# Altium schematic sheet SBH_BMS.SchDoc: Sample Sheet Title
size B; Date: 12/31/2022; Author: Flip B; Organization: ORGANIZATION; Address1: ADDRESS 1; Address2: ADDRESS 2; Address3: ADDRESS 3; Address4: ADDRESS 4; DocumentNumber: 1; Revision: -; SheetNumber: 1; SheetTotal: 8; ENG_APP_DATE: --/--/--; DSN_APP_DATE: --/--/--; CHK_APP_DATE: --/--/--
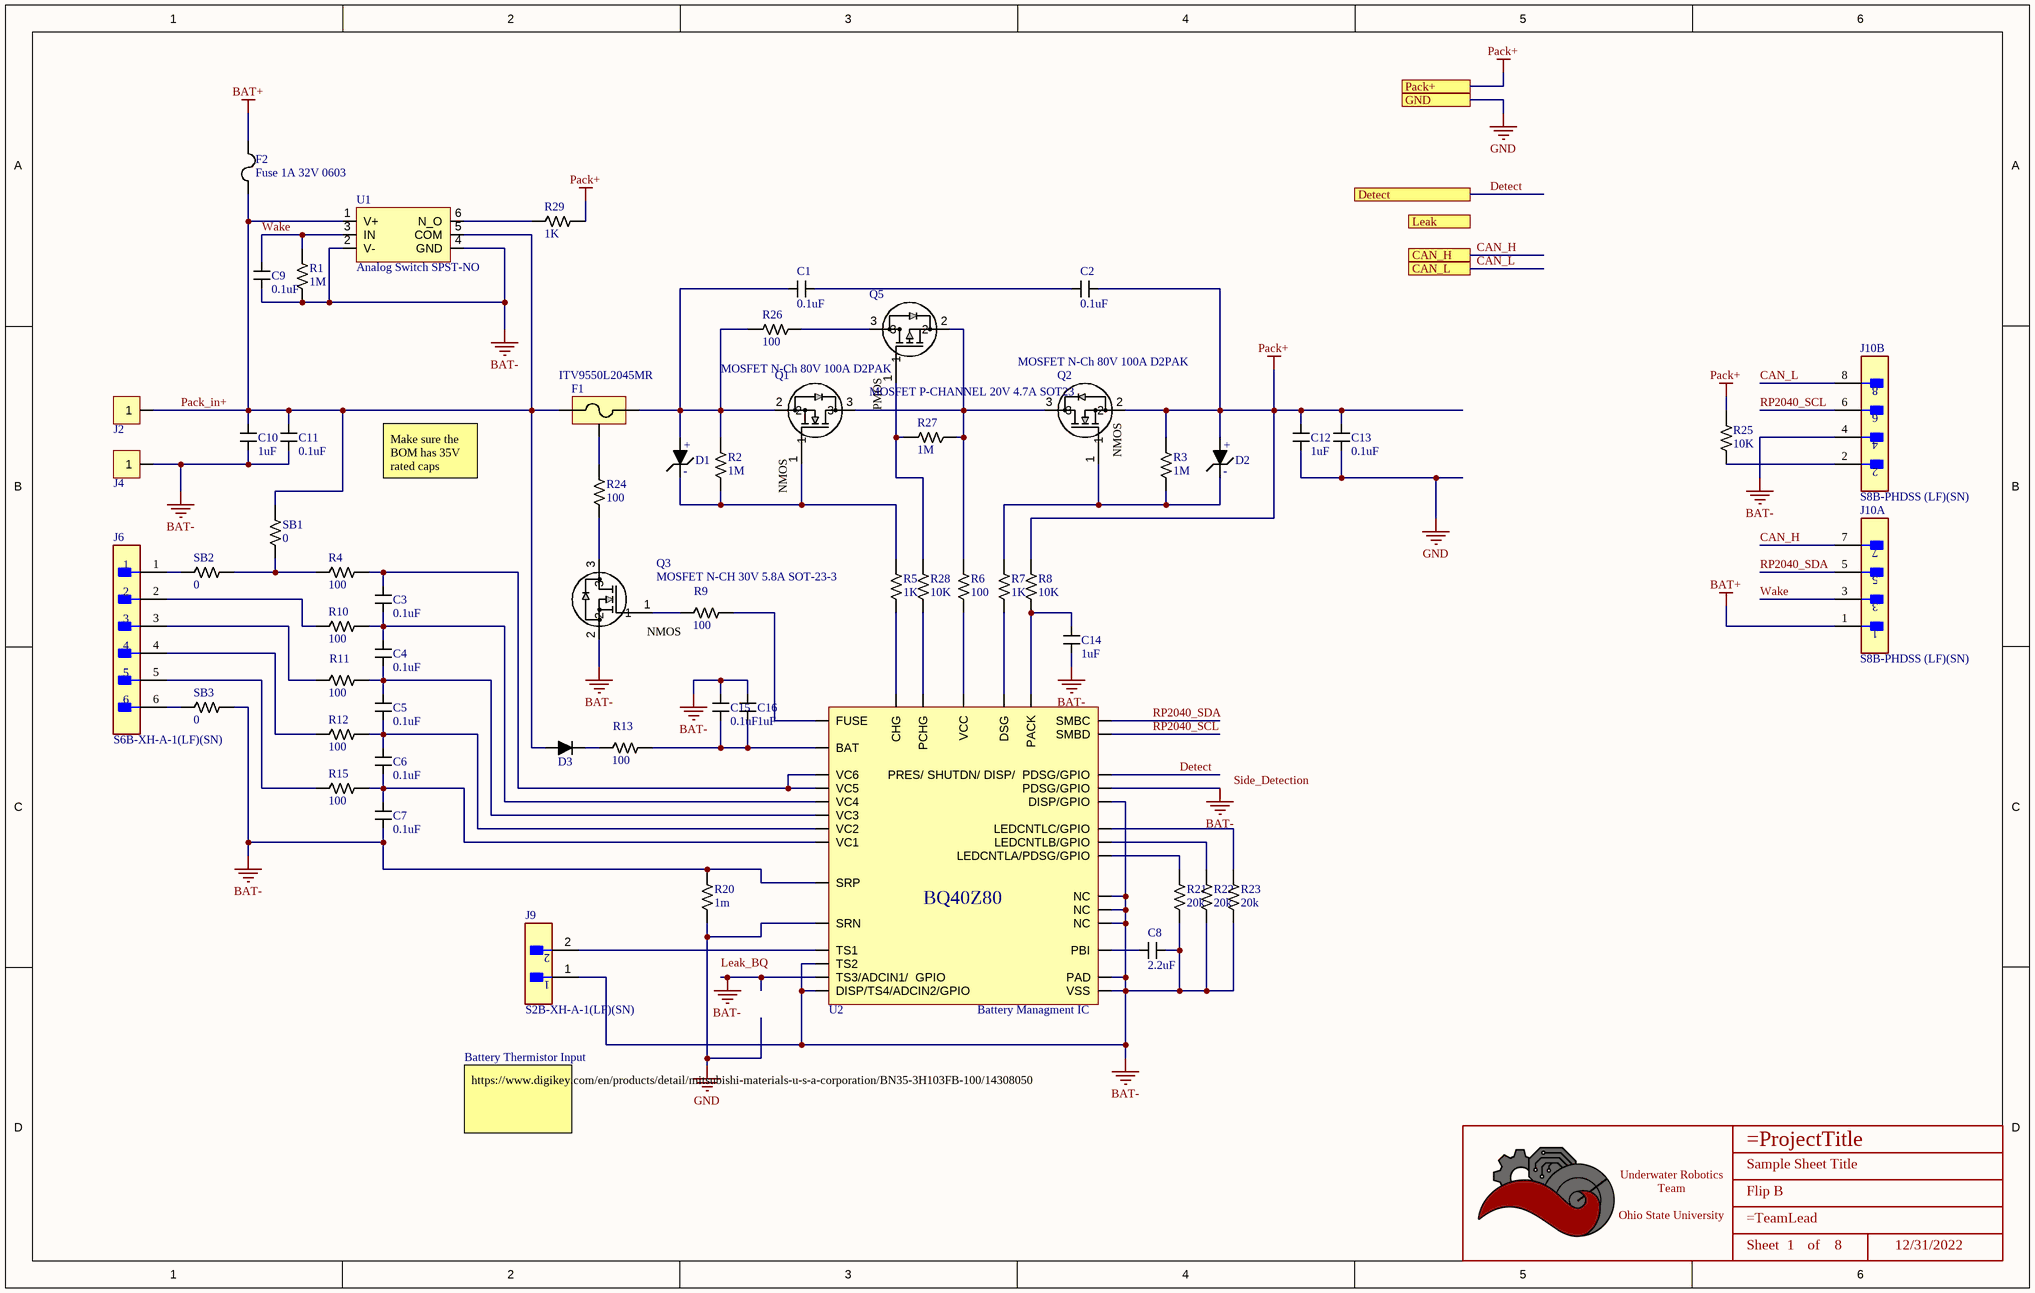
[diagram p0: SBH_BMS.SchDoc]

## Parts
*  Title_Block  [LOGO]  (value not drawn)  (graphical)
C1  value 0.1uF  [CAPACITOR_0402]  (hidden comment: 100nF Ceramic 25V)
C2  value 0.1uF  [CAPACITOR_0402]  (hidden comment: 100nF Ceramic 25V)
C3  value 0.1uF  [CAPACITOR_0402]  (hidden comment: 100nF Ceramic 25V)
C4  value 0.1uF  [CAPACITOR_0402]  (hidden comment: 100nF Ceramic 25V)
C5  value 0.1uF  [CAPACITOR_0402]  (hidden comment: 100nF Ceramic 25V)
C6  value 0.1uF  [CAPACITOR_0402]  (hidden comment: 100nF Ceramic 25V)
C7  value 0.1uF  [CAPACITOR_0402]  (hidden comment: 100nF Ceramic 25V)
C8  value 2.2uF  [CAPACITOR_0402]  (hidden comment: 2.2uF Ceramic 35V)
C9  value 0.1uF  [CAPACITOR_0402]  (hidden comment: 100nF Ceramic 25V)
C10  value 1uF  [CAPACITOR_0402]  (hidden comment: 1uF Ceramic 16V)
C11  value 0.1uF  [CAPACITOR_0402]  (hidden comment: 100nF Ceramic 25V)
C12  value 1uF  [CAPACITOR_0402]  (hidden comment: 1uF Ceramic 16V)
C13  value 0.1uF  [CAPACITOR_0402]  (hidden comment: 100nF Ceramic 25V)
C14  value 1uF  [CAPACITOR_0402]  (hidden comment: 1uF Ceramic 16V)
C15  value 0.1uF  [CAPACITOR_0402]  (hidden comment: 100nF Ceramic 25V)
C16  value 1uF  [CAPACITOR_0402]  (hidden comment: 1uF Ceramic 16V)
D1  Zener_Diode_16V_500mW  [SOD-123]  (value not drawn)
D2  Zener_Diode_16V_500mW  [SOD-123]  (value not drawn)
D3  MBR0520LT3G  [SOD-123]  (value not drawn)
F1  ITV9550L2045MR  [ITV9550]
F2  Fuse 1A 32V 0603  [2-SMD Fuse 0603]
J2  Redcube M4 Term 85A  [Redcube M4 Term 85A]  (value not drawn)
J4  Redcube M4 Term 85A  [Redcube M4 Term 85A]  (value not drawn)
J6  S6B-XH-A-1(LF)(SN)  [FP-S6B-XH-A-1_LF_SN-MFG]
J9  S2B-XH-A-1(LF)(SN)  [FP-S2B-XH-A-1_LF_SN-MFG]
J10  S8B-PHDSS (LF)(SN)  [FP-S8B-PHDSS_LF_SN-MFG]  (parts A,B of 2)
Q1  MOSFET N-Ch 80V 100A D2PAK  [D2PAK]
Q2  MOSFET N-Ch 80V 100A D2PAK  [D2PAK]
Q3  MOSFET N-CH 30V 5.8A SOT-23-3  [SOT-23-3]
Q5  MOSFET P-CHANNEL 20V 4.7A SOT23  [SOT-23-3]
R1  1M  [RESISTOR_0603]
R2  1M  [RESISTOR_0603]
R3  1M  [RESISTOR_0603]
R4  Value  (Ohms): 100  [RESISTOR_0402]  (hidden comment: 100 Ohm 5% 1/16W)
R5  Value  (Ohms): 1K  [RESISTOR_0402]  (hidden comment: 1k Ohm 1% 1/16W)
R6  Value  (Ohms): 100  [RESISTOR_0402]  (hidden comment: 100 Ohm 5% 1/16W)
R7  Value  (Ohms): 1K  [RESISTOR_0402]  (hidden comment: 1k Ohm 1% 1/16W)
R8  Value  (Ohms): 10K  [RESISTOR_0402]  (hidden comment: 10k Ohm 1% 1/16W)
R9  Value  (Ohms): 100  [RESISTOR_0402]  (hidden comment: 100 Ohm 5% 1/16W)
R10  Value  (Ohms): 100  [RESISTOR_0402]  (hidden comment: 100 Ohm 5% 1/16W)
R11  Value  (Ohms): 100  [RESISTOR_0402]  (hidden comment: 100 Ohm 5% 1/16W)
R12  Value  (Ohms): 100  [RESISTOR_0402]  (hidden comment: 100 Ohm 5% 1/16W)
R13  Value  (Ohms): 100  [RESISTOR_0402]  (hidden comment: 100 Ohm 5% 1/16W)
R15  Value  (Ohms): 100  [RESISTOR_0402]  (hidden comment: 100 Ohm 5% 1/16W)
R20  Value  (Ohms): 1m  [RES_CSS2H-3920]  (hidden comment: 1m Ohm 5% 8W)
R21  Value  (Ohms): 20k  [RESISTOR_0402]  (hidden comment: 20k Ohm 1% 1/16W)
R22  Value  (Ohms): 20k  [RESISTOR_0402]  (hidden comment: 20k Ohm 1% 1/16W)
R23  Value  (Ohms): 20k  [RESISTOR_0402]  (hidden comment: 20k Ohm 1% 1/16W)
R24  Value  (Ohms): 100  [RESISTOR_0402]  (hidden comment: 100 Ohm 5% 1/16W)
R25  Value  (Ohms): 10K  [RESISTOR_0603]  (hidden comment: 10k Ohm 5% 1/10W)
R26  Value  (Ohms): 100  [RESISTOR_0402]  (hidden comment: 100 Ohm 5% 1/16W)
R27  1M  [RESISTOR_0603]
R28  Value  (Ohms): 10K  [RESISTOR_0402]  (hidden comment: 10k Ohm 1% 1/16W)
R29  Value  (Ohms): 1K  [RESISTOR_0603]  (hidden comment: 1k Ohm 5% 1/8W)
SB1  Value  (Ohms): 0  [RESISTOR_0603]  (hidden comment: 0 Ohm Jumper No Fit)
SB2  Value  (Ohms): 0  [RESISTOR_0603]  (hidden comment: 0 Ohm Jumper No Fit)
SB3  Value  (Ohms): 0  [RESISTOR_0603]  (hidden comment: 0 Ohm Jumper No Fit)
U1  Analog Switch SPST-NO  [TSOT-23_S6]
U2  Battery Managment IC  [VQFN-32]

## Ports
CAN_H, CAN_L, Detect, GND, Leak, Pack+

## Nets
BAT+: F2.2 J10.1
BAT-: C7.2 C8.1 C9.2 C10.2 C11.2 C14.2 C15.1 C16.1 J4.1 J9.1 J10.4 Q3.2 R1.2 R20.1 R21.2 R22.2 R23.2 SB3.1 U1.2(V-) U1.4(GND) U2.7(NC) U2.8(SRP) U2.9(VSS) U2.11(TS2) U2.12(TS3/ADCIN1/__GPIO) U2.13(DISP/TS4/ADCIN2/GPIO) U2.14(NC) U2.15(DISP/GPIO) U2.16(PDSG/GPIO) U2.27(NC) U2.33(PAD)
GND: C12.2 C13.2 R20.2 U2.6(SRN) ; port GND
Pack+: C2.1 C12.1 C13.1 D2.1 Q2.2 R3.1 R8.1 R25.1 R29.1 ; port Pack+
CAN_H: J10.7 ; port CAN_H
CAN_L: J10.8 ; port CAN_L
Detect: U2.17(PRES/_SHUTDN/_DISP/__PDSG/GPIO) ; port Detect
Pack_in+: C10.1 C11.1 D3.1 F1.2 F2.1 J2.1 SB1.1 U1.1(V+) U1.5(COM)
RP2040_SCL: J10.6 U2.18(SMBD)
RP2040_SDA: J10.5 U2.19(SMBC)
Wake: C9.1 J10.3 R1.1 U1.3(IN)
NetC1_1: C1.1 C2.2
NetC1_2: C1.2 D1.1 F1.1 Q1.2 R2.1 R26.1
NetC3_1: C3.1 R4.1 U2.1(VC5) U2.32(VC6)
NetC3_2: C3.2 C4.1 R10.1 U2.2(VC4)
NetC4_2: C4.2 C5.1 R11.1 U2.3(VC3)
NetC5_2: C5.2 C6.1 R12.1 U2.4(VC2)
NetC6_2: C6.2 C7.1 R15.1 U2.5(VC1)
NetC8_2: C8.2 U2.31(PBI)
NetC14_1: C14.1 R8.2 U2.25(PACK)
NetC15_2: C15.2 C16.2 R13.1 U2.30(BAT)
NetD1_2: D1.2 Q1.1 R2.2 R5.1
NetD2_2: D2.2 Q2.1 R3.2 R7.1
NetD3_2: D3.2 R13.2
NetF1_3: F1.3 R24.1
NetJ6_1: J6.1 SB2.2
NetJ6_2: J6.2 R10.2
NetJ6_3: J6.3 R11.2
NetJ6_4: J6.4 R12.2
NetJ6_5: J6.5 R15.2
NetJ6_6: J6.6 SB3.2
NetJ9_2: J9.2 U2.10(TS1)
NetJ10_2: J10.2 R25.2
NetQ1_3: Q1.3 Q2.3 Q5.2 R6.1 R27.2
NetQ3_1: Q3.1 R9.2
NetQ3_3: Q3.3 R24.2
NetQ5_1: Q5.1 R27.1 R28.1
NetQ5_3: Q5.3 R26.2
NetR4_2: R4.2 SB1.2 SB2.1
NetR5_2: R5.2 U2.29(CHG)
NetR6_2: R6.2 U2.24(VCC)
NetR7_2: R7.2 U2.26(DSG)
NetR9_1: R9.1 U2.23(FUSE)
NetR21_1: R21.1 U2.20(LEDCNTLA/PDSG/GPIO)
NetR22_1: R22.1 U2.21(LEDCNTLB/GPIO)
NetR23_1: R23.1 U2.22(LEDCNTLC/GPIO)
NetR28_2: R28.2 U2.28(PCHG)
NetR29_2: R29.2 U1.6(N_O)

## Notes on the sheet
- Make sure the BOM has 35V rated caps
- Battery Thermistor Input
- https://www.digikey.com/en/products/detail/mitsubishi-materials-u-s-a-corporation/BN35-3H103FB-100/14308050
- Labels drawn without touching a wire or pin: Leak_BQ, Side_Detection
- DWG. NO.
- REV.
- SHT.
- THIS DOCUMENT AND THE DATA DISCLOSED HEREIN OR HEREWITH IS THE PROPERTY OF ALTIUM LIMITED AND MAY BE FREELY DISTRIBUTED IN WHOLE. NO RIGHTS ARE RESERVED OR EXPRESS OR IMPLIED WARANTEE GIVEN.
- REVISION
- DESCRIPTION
- DATE
- APPROVED
- ENG:
- APPROVALS
- PROJECT
- DSN:
- CHK:
- REFERENCE DOCUMENTS
- PROJECT REVISION:
- TITLE
- DOCUMENT REVISION:
- DESIGN ITEM:
- BOM:
- FAB DWG:
- PCB DWG:
- ASSY DWG:
- SCALE:
- SIZE
- B
- CAGE CODE
- FILE NAME
- DWG NO.
- SHEET
- OF
- REV
- (in symbol AO3404A) NMOS
- (in symbol BQ40Z80RSMT) BQ40Z80
- (in symbol PSMN4R4-80BS,118) NMOS
- (in symbol Title_Block) Underwater Robotics Team / Ohio State University; Sheet; of
- (in symbol TSM500P02CX) PMOS
- (in symbol Zener_Diode_16V_500mW) +; -

## Library data of the parts
* = Title_Block: UWRT Schematic Title Block Template / Created June 2021, Dylan Trainor
C1-C7 C9 C11 C13 C15 = CAPACITOR_0.1uF_0402: Cap 100nF 25V +/-10% / Ceramic 0402; Made By: Robert Pafford; Tolerance: +/- 10%; Voltage: 25V; Supplier 1: Digi-Key; Supplier Part Number 1: 478-7868-1-ND
C8 = CAPACITOR_2.2uF_0402: Cap 2.2uF 35V +/-10% / Ceramic 0402; Made By: Flip B; Tolerance: +/- 10%; Voltage: 35V; Supplier 1: Digi-Key; Supplier Part Number 1: 445-9028-1-ND
C10 C12 C14 C16 = CAPACITOR_1uF_0402: Cap 1uF 16V +/-10% / Ceramic 0402; Made By: Robert Pafford; Tolerance: +/- 10%; Voltage: 16V; Supplier 1: Digi-Key; Supplier Part Number 1: 478-0402YD105KAT4ADKR-ND
D1 D2 = Zener_Diode_16V_500mW: Zener Diode | 16 V | 500 mW | SOD-123; Made By: Flip B; Voltage - Zener: 16V; Power: 500mW; Package: SOD-123; ComponentLink1Description: Datasheet; ComponentLink1URL: https://www.panjit.com.tw/upload/datasheet/MMSZ5229A_SERIES.pdf; Supplier 1: Digi-Key; Supplier Part Number 1: 3757-MMSZ5246A_R1_00001CT-ND
D3 = SCHOTTKY_20V_500mA: Schottky Diode, 20V reverse breakdown, 500mA, Vf = 0.385V; Made By: Flip B; ComponentLink1Description: Datasheet; ComponentLink1URL: https://www.onsemi.com/pdf/datasheet/mbr0520lt1-d.pdf; Forward Voltage: 0.385V; Forward Current: 500mA; Package: SOD-123; Supplier 1: Digi-Key; Supplier Part Number 1: MBR0520LT3GOSCT-ND
F1 = ITV9550L2045MR: LittelFuse  | 45A | 5S | SMD | Self-Control Protector; Mfr_Name: Littelfuse Inc; Voltage Rating: 85V; Response Time: >1min for 2x45A; Breaking Capacity: 120A; Manufacturer_Part_Number: ITV9550L2045MR; Current Rating: 45A; Package: Proprietary; Created By: Flip B
F2 = ERB-RE1R00V: Pansonic | 32V | 1A | 0603 | Fast Blow; Mfr_Name: Panasonic; Breaking Capacity: 150A; Manufacturer_Part_Number: ERB-RE1R00V; Current Rating: 1A; Voltage Rating: 32V; Response Time: Fast Blow; Package: 1206; Created By: Nathan Ayer; Supplier 1: Digi-Key; Supplier Part Number 1: P15124CT-ND
J6 = CMP-17439-000023-1: CONN HEADER R/A P6OS 2.5MM; Voltage Rating: 250V; Insulation Resistance: 1GR; Current Rating: 3A; Number of Positions: 6; Gender: Male; Mount: Through Hole; Material: Polyamide; Max Operating Temperature: 85°C; Contact Plating: Tin; Number of Rows: 1; Color: Natural; Termination: Crimp; Min Operating Temperature: -25°C; Pitch: 2.5mm; Lead Free: Lead Free; Contact Material: Brass
J9 = CMP-17439-000260-1: CONN HEADER R/A 2POS 2.5MM; Voltage Rating: 250V; Number of Positions: 2; Contact Material: Brass; Series: XH; Contact Finish - Mating: TIN; Max Operating Temperature: 85°C; Number of Rows: 1; Packaging: Bulk; Insulation Color: Natural; Lead Free: Lead Free; Fastening Type: Detent; Termination: Press-Fit; Connector Type: Header; Insulation Material: Nylon; Contact Shape: Square; Contact Type: Male Pin; Mount: Through Hole; Min Operating Temperature: -25°C; Flammability Rating: UL94 V-0
J10 = CMP-17439-000572-2: CONN HEADER R/A 8POS 2MM; Row Spacing: 0.079inch; Voltage Rating: 250V; Number of Positions: 8; Fastening Type: Detent; Contact Finish - Mating: TIN; Mount: Through Hole; Connector Type: Header; Contact Plating: Tin; Contact Shape: Square; Insulation Material: Nylon; Contact Material: Copper Alloy; Termination: Solder; Packaging: Bulk; Series: PHD; Flammability Rating: UL94 V-0; Pitch: 2mm; Lead Free: Lead Free; Number of Rows: 2; Contact Type: Male Pin; Contact Mating Length: 0.114inch; Color: Natural; Insulation Color: Natural
Q1 Q2 = PSMN4R4-80BS,118: N-Channel 80V 100A (Ta) 306W (Ta), Surface Mount D2PAK; Vendor: Nexperia USA Inc.; Vgs (Max): +/- 20 V; Vgs (th): 3V; Rds (on): 3.8mOhm @ 25A, 10Vgs; Amp Rating: 100A; FET Type: N-Channel; Package: D2PAK; Manufacturer _Part_Number: PSMN4R4-80BS,118; Vdss: 80 V; Power Dissipation: 306W; Created By: Flip B; Supplier 1: Digi-Key; Supplier Part Number 1: 1727-7123-1-ND
Q3 = AO3404A: N-Channel 30 V 5.8A (Ta) 1.4W (Ta) Surface Mount SOT-23-3; Vendor: Alpha & Omega Semiconductor Inc.; SourceLibrary: ON_Semiconductor_2020-01-13; Vgs (Max): 3V @ 5.8A, 10V; Vgs (th): 3V @ 250µA; Rds (on): 28mOhm @ 5.8A, 10V; Amp Rating: 5.8 A; FET Type: N-Channel; Package: SOT23-3L; Manufacturer _Part_Number: AO3404A; Vdss: 30V; Power Dissipation: 1.4W (Ta); Supplier 1: Digi-Key; Supplier Part Number 1: 785-1004-1-ND; Created By: Dylan T
Q5 = TSM500P02CX: P-Channel 20 V 4.7A (Tc) 1.56W (Tc) Surface Mount SOT-23; Vendor: Taiwan Semiconductor Corporation; Vgs (Max): ±10V; Vgs (th): 800mV @ 250µA; Rds (on): 50mOhm @ 3A, 4.5V; Amp Rating: 4.7 A; FET Type: P-Channel; Package: TO-236-3, SC-59, SOT-23-3; Manufacturer_Part_Number: TSM500P02CX; Vdss: 20 V; Power Dissipation: 1.56W (Tc); Created By: Robert Pafford; Supplier 1: Digi-Key; Supplier Part Number 1: TSM500P02CXRFGCT-ND
R1-R3 R27 = RESISTOR_1M_0603: RES 1M OHM 1/8W 0603; Tolerance: +/- 5%; Made By: Robert Pafford; ComponentLink1Description: Datasheet; ComponentLink1URL: https://www.bourns.com/docs/product-datasheets/CRxxxxx.pdf; Wattage: 1/8W; Supplier: Digikey; Digikey Part Numer: CR0603-JW-104ELFTR-ND; Supplier 1: Digi-Key; Supplier Part Number 1: RMCF0603JT1M00CT-ND; Value  (Ohms): 1M
R4 R6 R9-R13 R15 R24 R26 = RESISTOR_100_0402: RES 100 OHM 5% 1/16W 0402; Tolerance: +/- 5%; Made By: Flip B; Wattage: 1/16W; Supplier: Digikey; Digikey Part Numer: 311-100JRTR-ND; Supplier 1: Digi-Key; Supplier Part Number 1: 311-100JRCT-ND
R5 R7 = RESISTOR_1K_0402: RES 1k OHM 1% 1/16W 0402; Tolerance: +/- 1%; Made By: Robert Pafford; Wattage: 1/16W; Supplier: Digikey; Digikey Part Numer: CR0603-JW-104ELFTR-ND; Supplier 1: Digi-Key; Supplier Part Number 1: 13-AC0402FR-131KLCT-ND
R8 R28 = RESISTOR_10K_0402: RES 10k OHM 1% 1/16W 0402; Tolerance: +/- 1%; Made By: Robert Pafford; Wattage: 1/16W; Supplier: Digikey; Digikey Part Numer: CR0603-JW-104ELFTR-ND; Supplier 1: Digi-Key; Supplier Part Number 1: YAG3436CT-ND
R20 = RESISTOR_1m_CS: RES 1m OHM 1% 8W Current Sense; Tolerance: +/- 1%; Made By: Flip B; ComponentLink1Description: Datasheet; ComponentLink1URL: https://www.bourns.com/docs/product-datasheets/css2h-3920.pdf; Wattage: 8W; Supplier 1: Digi-Key; Supplier Part Number 1: CSS2H-3920R-1L00FCT-ND
R21-R23 = RESISTOR_20K_0402: RES 20k OHM 1% 1/16W 0402; Tolerance: +/- 1%; Made By: Flip B; Wattage: 1/16W; Supplier 1: Digi-Key; Supplier Part Number 1: 311-20.0KLRCT-ND
R25 = RESISTOR_10K_0603: RES 10k OHM 5% 1/10W 0603; Tolerance: +/- 5%; Wattage: 1/8W; Made By: Robert Pafford; ComponentLink1Description: Datasheet; ComponentLink1URL: https://www.bourns.com/docs/product-datasheets/CRxxxxx.pdf; Supplier: Digikey; Digikey Part Numer: CR0603-JW-104ELFTR-ND; Supplier 1: Digi-Key; Supplier Part Number 1: 2019-RK73B1JTTD103JCT-ND
R29 = RESISTOR_1K_0603: RES 1k OHM 5% 1/8W 0603; Tolerance: +/- 5%; Made By: Robert Pafford; ComponentLink1Description: Datasheet; ComponentLink1URL: https://www.bourns.com/docs/product-datasheets/CRxxxxx.pdf; Wattage: 1/8W; Supplier: Digikey; Digikey Part Numer: CR0603-JW-104ELFTR-ND; Supplier 1: Digi-Key; Supplier Part Number 1: 2019-RK73B1JTTD102JCT-ND
SB1-SB3 = JUMPER_0_0603: 0 Ohm Jumper No Fit for Solder Bridge; Made By: Robert Pafford; ComponentLink1Description: Digikey; ComponentLink1URL: https://www.digikey.com/en/products/detail/koa-speer-electronics-inc/RK73B1JTTD101J/9844701
U1 = MAX4520EUT+T: Analog Switch SPST Normally Open; MF: Analog Devices; On resistance: 160Ohm; Voltage: 9-36V; Package: SOT-23-6 Analog Devices; Circuit: SPST; Created By: Flip B; ComponentLink1Description: Datasheet; ComponentLink1URL: https://www.analog.com/media/en/technical-documentation/data-sheets/max4510-max4520.pdf; Supplier 1: Digi-Key; Supplier Part Number 1: MAX4520EUT+TCT-ND
U2 = BQ40Z80RSMT: Multifuntion Li-ion/ Lipo Battery Pack Managment IC; Manufacturer: Texas Instruments; No. Of Cells: 2S-6S; Supply Voltage: 2.2V - 32V; Quiescent Current: 50mA; ComponentLink1Description: Datasheet; ComponentLink1URL: https://www.ti.com/lit/ds/symlink/bq40z80.pdf?HQS=dis-dk-null-digikeymode-dsf-pf-null-wwe&ts=1672534896638&ref_url=https%253A%252F%252Fwww.ti.com%252Fgeneral%252Fdocs%252Fsuppproductinfo.tsp%253FdistId%253D10%2526gotoUrl%253Dhttps%253A%252F%252Fwww.ti.com%252Flit%252Fgpn%252Fbq40z80; Created By: Flip B; PartNumber: BQ40Z80RSMT; Supplier 1: Digi-Key; Supplier Part Number 1: 296-BQ40Z80RSMTCT-ND
J2 J4 = Redcube M4 Term 85A: Created By: Nahtan Ayer; Current Rating: 85 A; Screw Size: M4